# Altium project lockdriver.PrjPCB
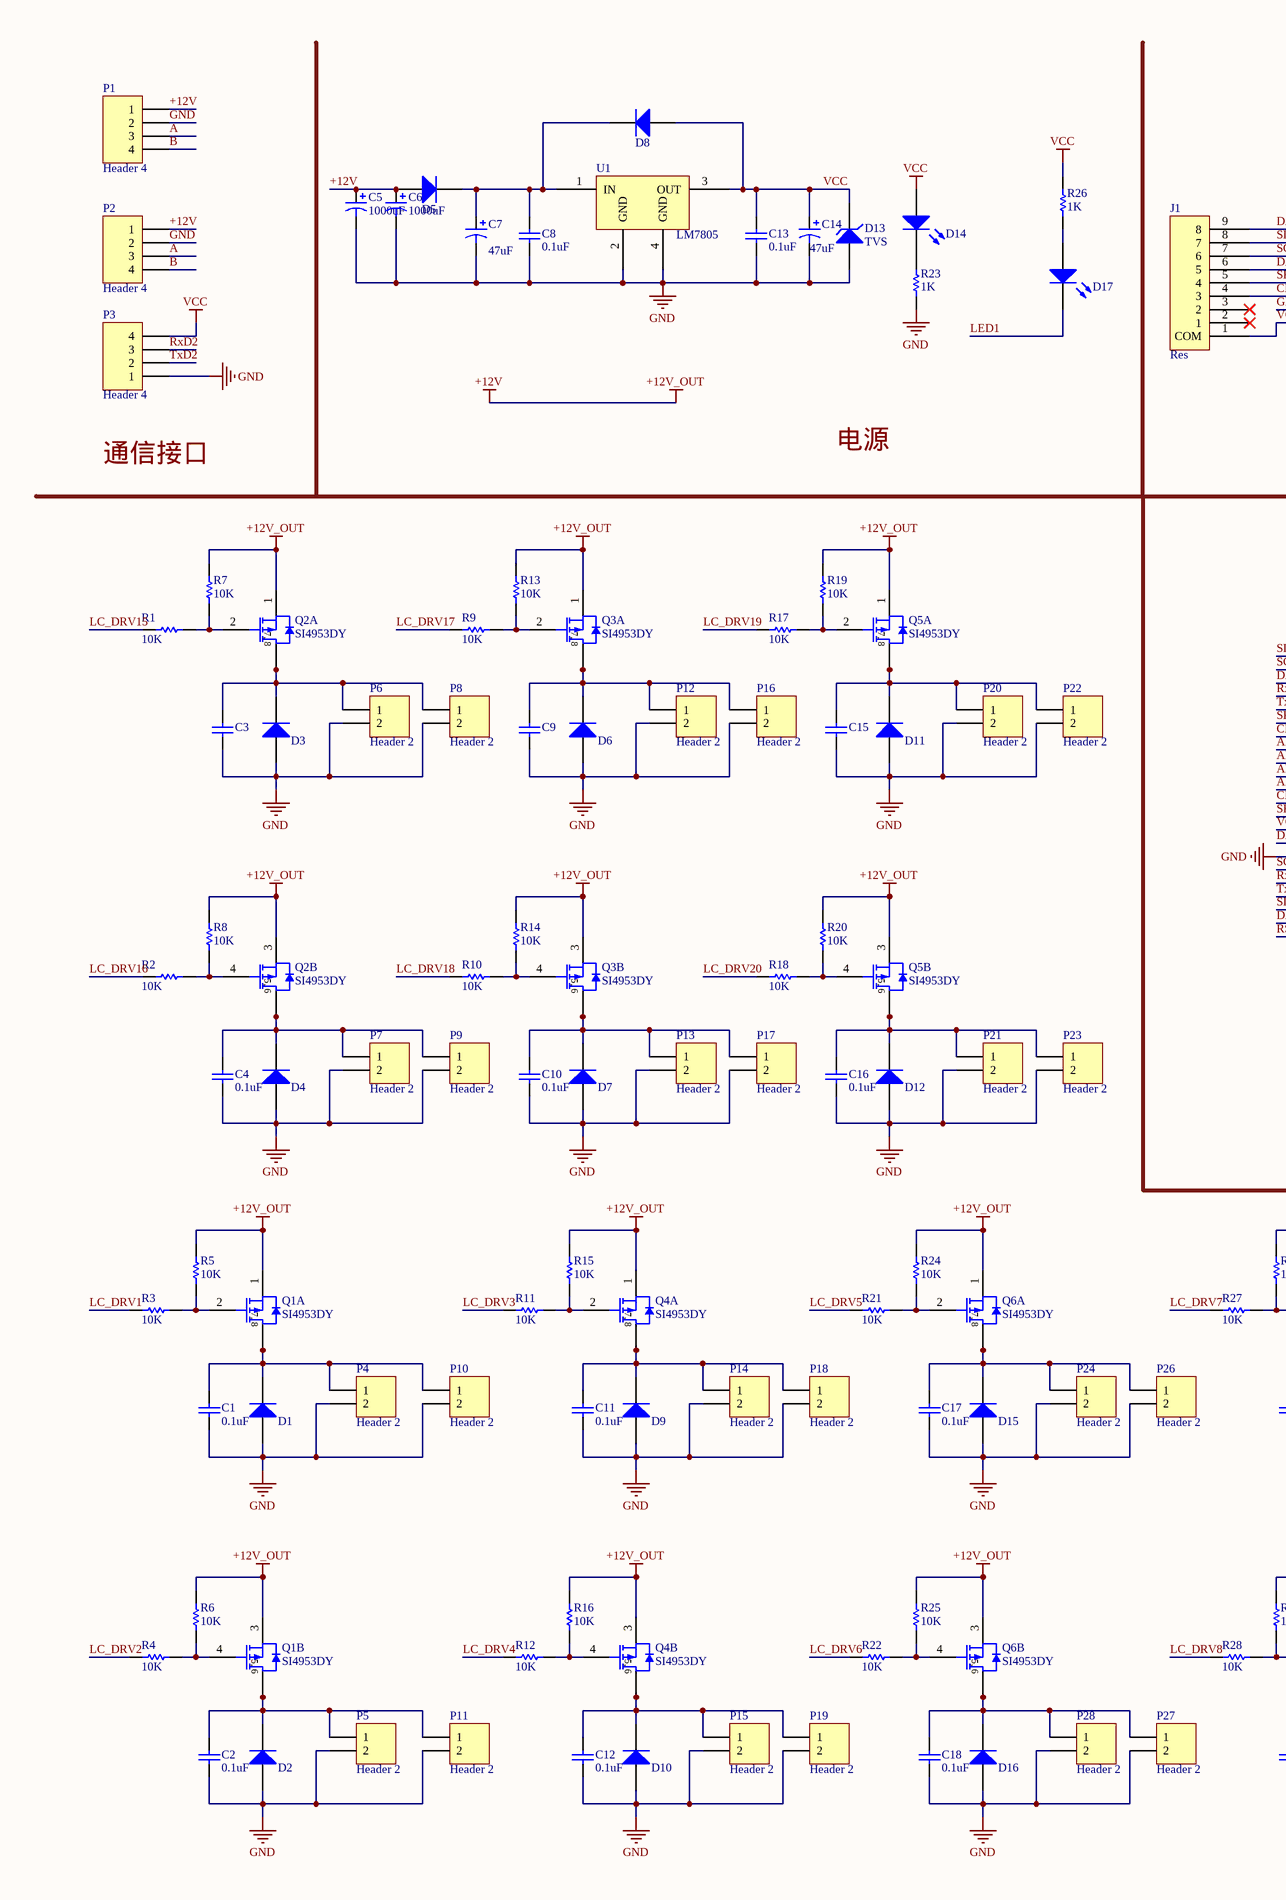
[diagram p0: lockdriver.SchDoc, left]
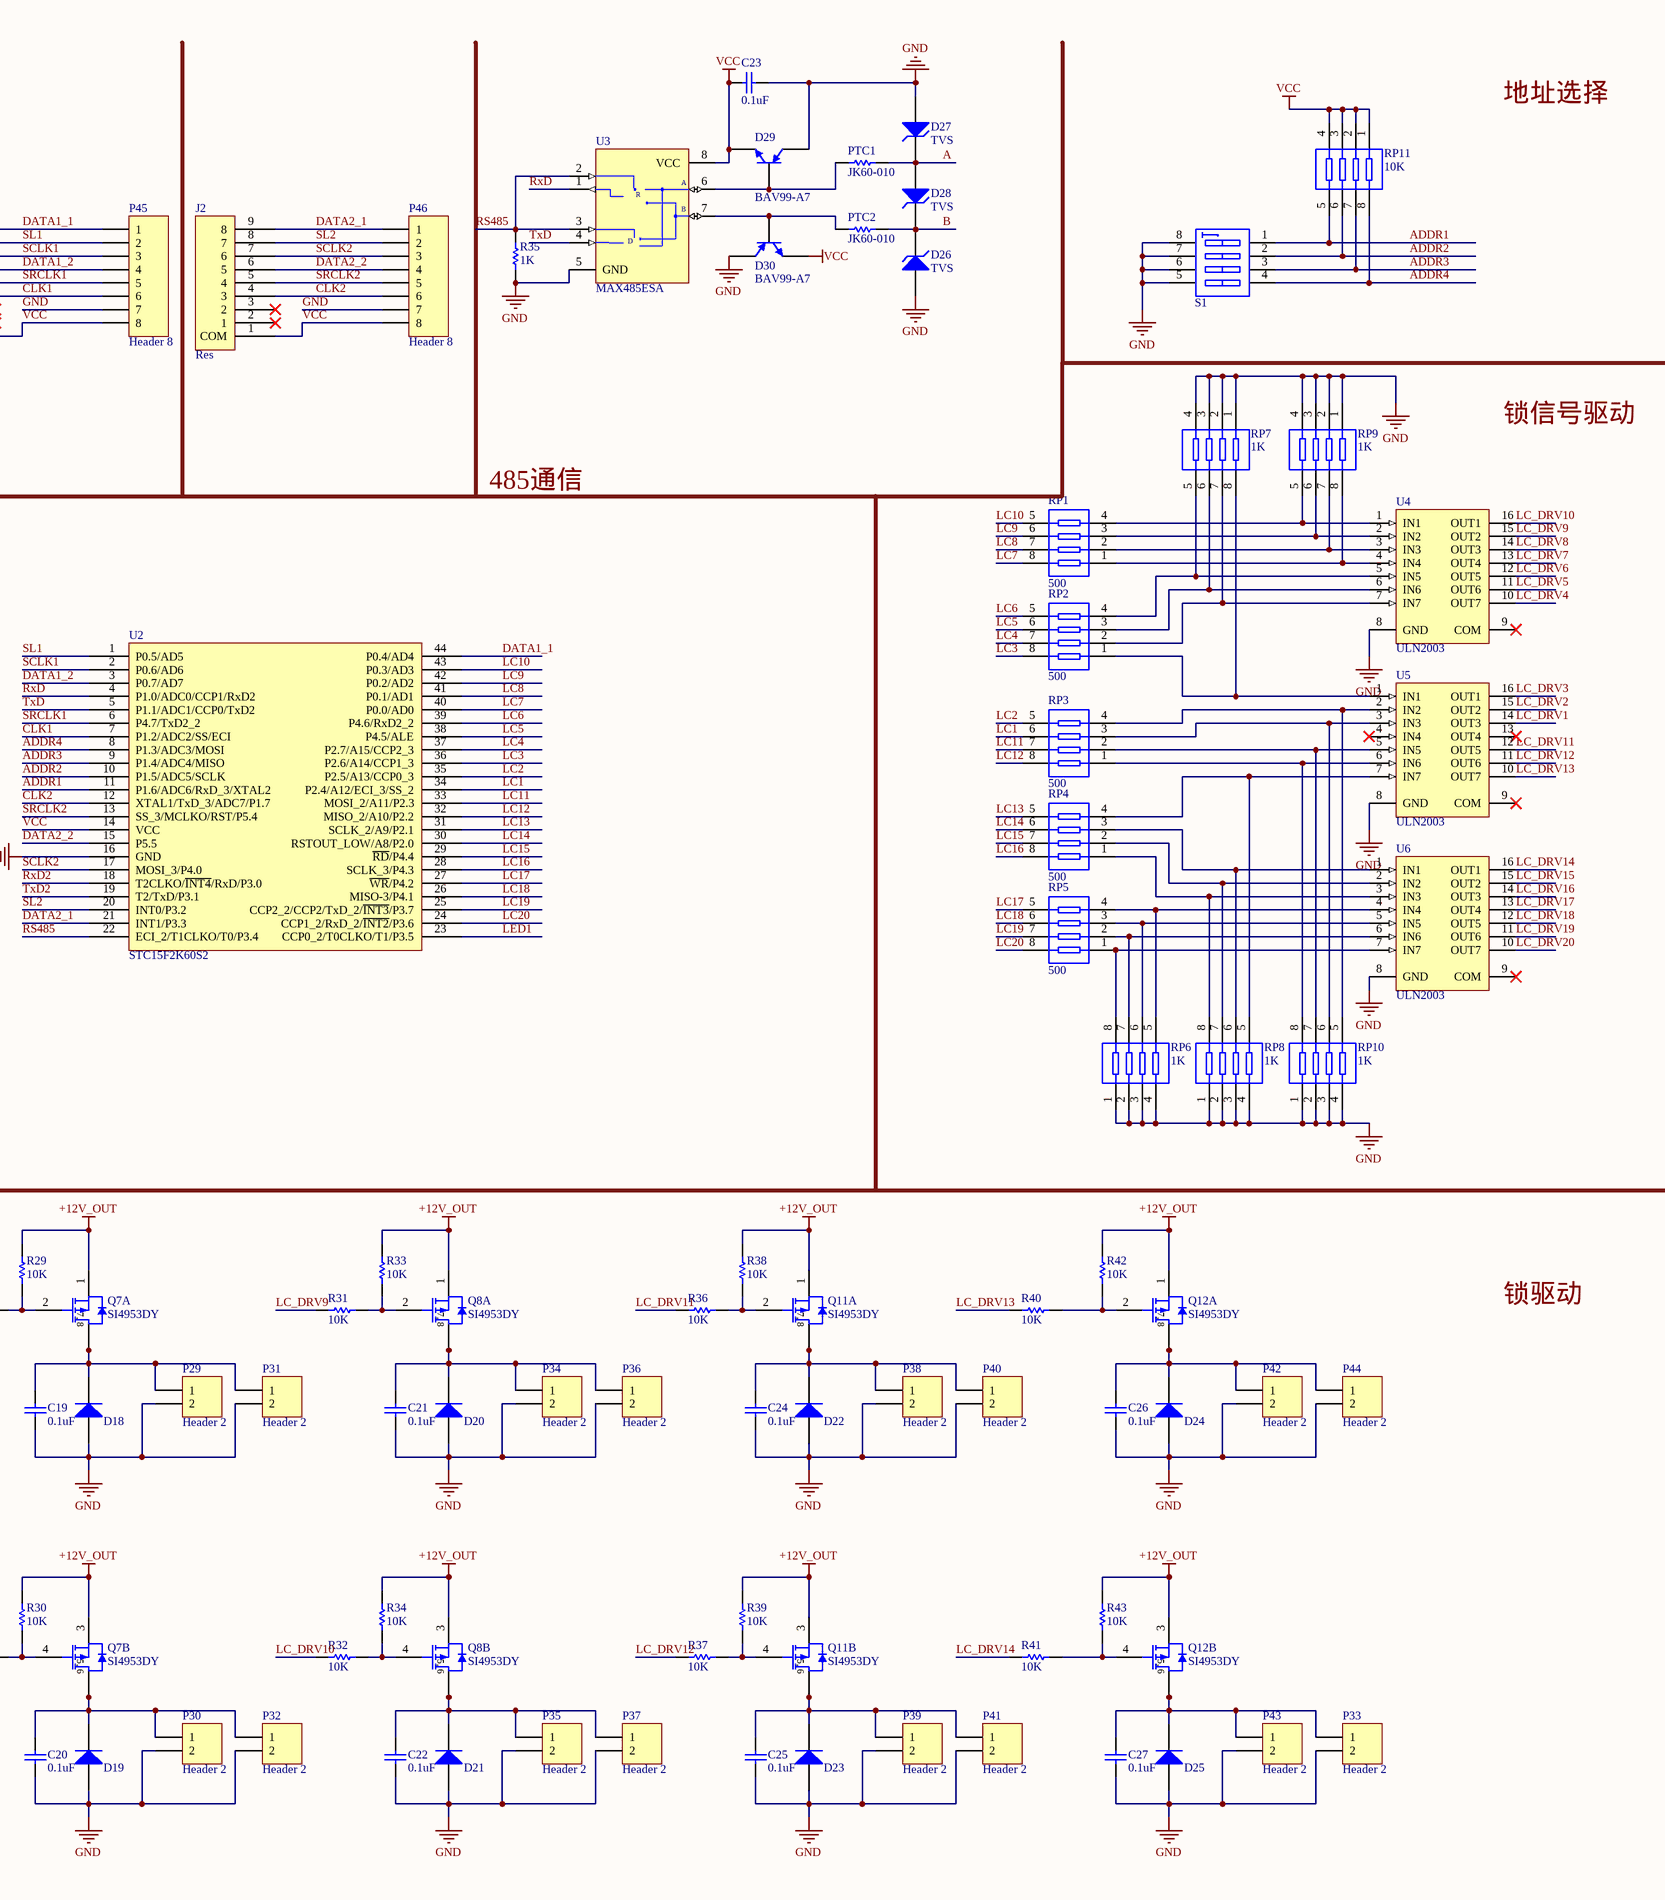
[diagram p1: lockdriver.SchDoc, right]
1 sheet, 177 parts. Net scope: global (net labels, ports and power ports of the same name join across sheets).
Board file: 20门锁控.PcbDoc

## Sheet lockdriver.SchDoc
size A2

### Parts
C1  0.1uF  [CAPC2012M]
C2  0.1uF  [CAPC2012M]
C3  0.1uF  [CAPC2012M]  (value not drawn)
C4  0.1uF  [CAPC2012M]
C5  1000uF  [CAPPR5-10x12.5]
C6  1000uF  [CAPPR5-10x12.5]
C7  value 47uF  [CAPPR2-5x11.5]  (hidden comment: Cap Pol2)
C8  0.1uF  [CAPC2012M]
C9  0.1uF  [CAPC2012M]  (value not drawn)
C10  0.1uF  [CAPC2012M]
C11  0.1uF  [CAPC2012M]
C12  0.1uF  [CAPC2012M]
C13  0.1uF  [CAPC2012M]
C14  value 47uF  [CAPPR2-5x11.5]  (hidden comment: Cap Pol2)
C15  0.1uF  [CAPC2012M]  (value not drawn)
C16  0.1uF  [CAPC2012M]
C17  0.1uF  [CAPC2012M]
C18  0.1uF  [CAPC2012M]
C19  0.1uF  [CAPC2012M]
C20  0.1uF  [CAPC2012M]
C21  0.1uF  [CAPC2012M]
C22  0.1uF  [CAPC2012M]
C23  0.1uF  [CAPC2012M]
C24  0.1uF  [CAPC2012M]
C25  0.1uF  [CAPC2012M]
C26  0.1uF  [CAPC2012M]
C27  0.1uF  [CAPC2012M]
D1  1N4007  [DSO-C2/X1.8]  (value not drawn)
D2  1N4007  [DSO-C2/X1.8]  (value not drawn)
D3  1N4007  [DSO-C2/X1.8]  (value not drawn)
D4  1N4007  [DSO-C2/X1.8]  (value not drawn)
D5  1N4007  [DSO-C2/X1.8]  (value not drawn)
D6  1N4007  [DSO-C2/X1.8]  (value not drawn)
D7  1N4007  [DSO-C2/X1.8]  (value not drawn)
D8  1N4007  [DSO-C2/X1.8]  (value not drawn)
D9  1N4007  [DSO-C2/X1.8]  (value not drawn)
D10  1N4007  [DSO-C2/X1.8]  (value not drawn)
D11  1N4007  [DSO-C2/X1.8]  (value not drawn)
D12  1N4007  [DSO-C2/X1.8]  (value not drawn)
D13  TVS  [DSO-C2/X1.8]
D14  LED  [LED2012M]  (value not drawn)
D15  1N4007  [DSO-C2/X1.8]  (value not drawn)
D16  1N4007  [DSO-C2/X1.8]  (value not drawn)
D17  LED  [LED2012M]  (value not drawn)
D18  1N4007  [DSO-C2/X1.8]  (value not drawn)
D19  1N4007  [DSO-C2/X1.8]  (value not drawn)
D20  1N4007  [DSO-C2/X1.8]  (value not drawn)
D21  1N4007  [DSO-C2/X1.8]  (value not drawn)
D22  1N4007  [DSO-C2/X1.8]  (value not drawn)
D23  1N4007  [DSO-C2/X1.8]  (value not drawn)
D24  1N4007  [DSO-C2/X1.8]  (value not drawn)
D25  1N4007  [DSO-C2/X1.8]  (value not drawn)
D26  TVS  [DSO-C2/X1.8]
D27  TVS  [DSO-C2/X1.8]
D28  TVS  [DSO-C2/X1.8]
D29  BAV99-A7  [SOT23-3M]
D30  BAV99-A7  [SOT23-3M]
J1  Res  [SIP9]
J2  Res  [SIP9]
P1  Header 4  [VH396-4]
P2  Header 4  [VH396-4]
P3  Header 4  [HDR1X4]
P4  Header 2  [VH396-2]
P5  Header 2  [VH396-2]
P6  Header 2  [VH396-2]
P7  Header 2  [VH396-2]
P8  Header 2  [XH254-2]
P9  Header 2  [XH254-2]
P10  Header 2  [XH254-2]
P11  Header 2  [XH254-2]
P12  Header 2  [VH396-2]
P13  Header 2  [VH396-2]
P14  Header 2  [VH396-2]
P15  Header 2  [VH396-2]
P16  Header 2  [XH254-2]
P17  Header 2  [XH254-2]
P18  Header 2  [XH254-2]
P19  Header 2  [XH254-2]
P20  Header 2  [VH396-2]
P21  Header 2  [VH396-2]
P22  Header 2  [XH254-2]
P23  Header 2  [XH254-2]
P24  Header 2  [VH396-2]
P26  Header 2  [XH254-2]
P27  Header 2  [XH254-2]
P28  Header 2  [VH396-2]
P29  Header 2  [VH396-2]
P30  Header 2  [VH396-2]
P31  Header 2  [XH254-2]
P32  Header 2  [XH254-2]
P33  Header 2  [XH254-2]
P34  Header 2  [VH396-2]
P35  Header 2  [VH396-2]
P36  Header 2  [XH254-2]
P37  Header 2  [XH254-2]
P38  Header 2  [VH396-2]
P39  Header 2  [VH396-2]
P40  Header 2  [XH254-2]
P41  Header 2  [XH254-2]
P42  Header 2  [VH396-2]
P43  Header 2  [VH396-2]
P44  Header 2  [XH254-2]
P45  Header 8  [XH254-8]
P46  Header 8  [XH254-8]
PTC1  JK60-010  [RESC2012M]
PTC2  JK60-010  [RESC2012M]
Q1  SI4953DY  [SO8_M]  (parts A,B of 2)
Q2  SI4953DY  [SO8_M]  (parts A,B of 2)
Q3  SI4953DY  [SO8_M]  (parts A,B of 2)
Q4  SI4953DY  [SO8_M]  (parts A,B of 2)
Q5  SI4953DY  [SO8_M]  (parts A,B of 2)
Q6  SI4953DY  [SO8_M]  (parts A,B of 2)
Q7  SI4953DY  [SO8_M]  (parts A,B of 2)
Q8  SI4953DY  [SO8_M]  (parts A,B of 2)
Q11  SI4953DY  [SO8_M]  (parts A,B of 2)
Q12  SI4953DY  [SO8_M]  (parts A,B of 2)
R1  10K  [RESC2012M]
R2  10K  [RESC2012M]
R3  10K  [RESC2012M]
R4  10K  [RESC2012M]
R5  10K  [RESC2012M]
R6  10K  [RESC2012M]
R7  10K  [RESC2012M]
R8  10K  [RESC2012M]
R9  10K  [RESC2012M]
R10  10K  [RESC2012M]
R11  10K  [RESC2012M]
R12  10K  [RESC2012M]
R13  10K  [RESC2012M]
R14  10K  [RESC2012M]
R15  10K  [RESC2012M]
R16  10K  [RESC2012M]
R17  10K  [RESC2012M]
R18  10K  [RESC2012M]
R19  10K  [RESC2012M]
R20  10K  [RESC2012M]
R21  10K  [RESC2012M]
R22  10K  [RESC2012M]
R23  1K  [RESC2012M]
R24  10K  [RESC2012M]
R25  10K  [RESC2012M]
R26  1K  [RESC2012M]
R27  10K  [RESC2012M]
R28  10K  [RESC2012M]
R29  10K  [RESC2012M]
R30  10K  [RESC2012M]
R31  10K  [RESC2012M]
R32  10K  [RESC2012M]
R33  10K  [RESC2012M]
R34  10K  [RESC2012M]
R35  1K  [RESC2012M]
R36  10K  [RESC2012M]
R37  10K  [RESC2012M]
R38  10K  [RESC2012M]
R39  10K  [RESC2012M]
R40  10K  [RESC2012M]
R41  10K  [RESC2012M]
R42  10K  [RESC2012M]
R43  10K  [RESC2012M]
RP1  500  [EXB38V]
RP2  500  [EXB38V]
RP3  500  [EXB38V]
RP4  500  [EXB38V]
RP5  500  [EXB38V]
RP6  1K  [EXB38V]
RP7  1K  [EXB38V]
RP8  1K  [EXB38V]
RP9  1K  [EXB38V]
RP10  1K  [EXB38V]
RP11  10K  [EXB38V]
S1  SW DIP-4  [SWITCH-8]  (value not drawn)
U1  LM7805  [SOT223-4M]
U2  STC15F2K60S2  [LQFP-44]
U3  MAX485ESA  [SO8_M]
U4  ULN2003  [SO16_M]
U5  ULN2003  [SO16_M]
U6  ULN2003  [SO16_M]

### Nets
+12V: C5.1 C6.1 D5.1(A) P1.1 P2.1 Q1.1(S) Q1.3(S) Q2.1(S) Q2.3(S) Q3.1(S) Q3.3(S) Q4.1(S) Q4.3(S) Q5.1(S) Q5.3(S) Q6.1(S) Q6.3(S) Q7.1(S) Q7.3(S) Q8.1(S) Q8.3(S) Q11.1(S) Q11.3(S) Q12.1(S) Q12.3(S) R5.2 R6.2 R7.2 R8.2 R13.2 R14.2 R15.2 R16.2 R19.2 R20.2 R24.2 R25.2 R29.2 R30.2 R33.2 R34.2 R38.2 R39.2 R42.2 R43.2  [also labelled +12V_OUT]
GND: C1.1 C2.1 C3.1 C4.1 C5.2 C6.2 C7.2 C8.1 C9.1 C10.1 C11.1 C12.1 C13.2 C14.2 C15.1 C16.1 C17.1 C18.1 C19.1 C20.1 C21.1 C22.1 C23.2 C24.1 C25.1 C26.1 C27.1 D1.1(A) D2.1(A) D3.1(A) D4.1(A) D6.1(A) D7.1(A) D9.1(A) D10.1(A) D11.1(A) D12.1(A) D13.1(A) D15.1(A) D16.1(A) D18.1(A) D19.1(A) D20.1(A) D21.1(A) D22.1(A) D23.1(A) D24.1(A) D25.1(A) D26.1(A) D27.1(A) D29.1(C) D30.1(C) P1.2 P2.2 P3.1 P4.2 P5.2 P6.2 P7.2 P8.2 P9.2 P10.2 P11.2 P12.2 P13.2 P14.2 P15.2 P16.2 P17.2 P18.2 P19.2 P20.2 P21.2 P22.2 P23.2 P24.2 P26.2 P27.2 P28.2 P29.2 P30.2 P31.2 P32.2 P33.2 P34.2 P35.2 P36.2 P37.2 P38.2 P39.2 P40.2 P41.2 P42.2 P43.2 P44.2 P45.7 P46.7 R23.1 R35.1 RP6.1 RP6.2 RP6.3 RP6.4 RP7.1 RP7.2 RP7.3 RP7.4 RP8.1 RP8.2 RP8.3 RP8.4 RP9.1 RP9.2 RP9.3 RP9.4 RP10.1 RP10.2 RP10.3 RP10.4 S1.5(B4) S1.6(B3) S1.7(B2) S1.8(B1) U1.2(GND) U1.4(GND) U2.16(GND) U3.5(GND) U4.8(GND) U5.8(GND) U6.8(GND)
VCC: C13.1 C14.1 C23.1 D8.1(A) D13.2(K) D14.1(A) D29.2(E) D30.2(E) J1.1(COM) J2.1(COM) P3.4 P45.8 P46.8 R26.2 RP11.1 RP11.2 RP11.3 RP11.4 U1.3(OUT) U2.14(VCC) U3.8(VCC)
A: D27.2(K) D28.1(A) P1.3 P2.3 PTC1.2
ADDR1: RP11.5 S1.1(A1) U2.11(P1.6/ADC6/RxD_3/XTAL2)
ADDR2: RP11.6 S1.2(A2) U2.10(P1.5/ADC5/SCLK)
ADDR3: RP11.7 S1.3(A3) U2.9(P1.4/ADC4/MISO)
ADDR4: RP11.8 S1.4(A4) U2.8(P1.3/ADC3/MOSI)
B: D26.2(K) D28.2(K) P1.4 P2.4 PTC2.2
CLK1: J1.4(3) P45.6 U2.7(P1.2/ADC2/SS/ECI)
CLK2: J2.4(3) P46.6 U2.12(XTAL1/TxD_3/ADC7/P1.7)
DATA1_1: J1.9(8) P45.1 U2.44(P0.4/AD4)
DATA1_2: J1.6(5) P45.4 U2.3(P0.7/AD7)
DATA2_1: J2.9(8) P46.1 U2.21(INT1/P3.3)
DATA2_2: J2.6(5) P46.4 U2.15(P5.5)
LC1: RP3.6 U2.34(P2.4/A12/ECI_3/SS_2)
LC2: RP3.5 U2.35(P2.5/A13/CCP0_3)
LC3: RP2.8 U2.36(P2.6/A14/CCP1_3)
LC4: RP2.7 U2.37(P2.7/A15/CCP2_3)
LC5: RP2.6 U2.38(P4.5/ALE)
LC6: RP2.5 U2.39(P4.6/RxD2_2)
LC7: RP1.8 U2.40(P0.0/AD0)
LC8: RP1.7 U2.41(P0.1/AD1)
LC9: RP1.6 U2.42(P0.2/AD2)
LC10: RP1.5 U2.43(P0.3/AD3)
LC11: RP3.7 U2.33(MOSI_2/A11/P2.3)
LC12: RP3.8 U2.32(MISO_2/A10/P2.2)
LC13: RP4.5 U2.31(SCLK_2/A9/P2.1)
LC14: RP4.6 U2.30(RSTOUT_LOW/A8/P2.0)
LC15: RP4.7 U2.29(~{RD}/P4.4)
LC16: RP4.8 U2.28(SCLK_3/P4.3)
LC17: RP5.5 U2.27(~{WR}/P4.2)
LC18: RP5.6 U2.26(MISO-3/P4.1)
LC19: RP5.7 U2.25(CCP2_2/CCP2/TxD_2/~{INT3}/P3.7)
LC20: RP5.8 U2.24(CCP1_2/RxD_2/~{INT2}/P3.6)
LC_DRV1: R3.1 U5.14(OUT3)
LC_DRV2: R4.1 U5.15(OUT2)
LC_DRV3: R11.1 U5.16(OUT1)
LC_DRV4: R12.1 U4.10(OUT7)
LC_DRV5: R21.1 U4.11(OUT6)
LC_DRV6: R22.1 U4.12(OUT5)
LC_DRV7: R27.1 U4.13(OUT4)
LC_DRV8: R28.1 U4.14(OUT3)
LC_DRV9: R31.1 U4.15(OUT2)
LC_DRV10: R32.1 U4.16(OUT1)
LC_DRV11: R36.1 U5.12(OUT5)
LC_DRV12: R37.1 U5.11(OUT6)
LC_DRV13: R40.1 U5.10(OUT7)
LC_DRV14: R41.1 U6.16(OUT1)
LC_DRV15: R1.1 U6.15(OUT2)
LC_DRV16: R2.1 U6.14(OUT3)
LC_DRV17: R9.1 U6.13(OUT4)
LC_DRV18: R10.1 U6.12(OUT5)
LC_DRV19: R17.1 U6.11(OUT6)
LC_DRV20: R18.1 U6.10(OUT7)
LED1: D17.2(K) U2.23(CCP0_2/T0CLKO/T1/P3.5)
RS485: R35.2 U2.22(ECI_2/T1CLKO/T0/P3.4) U3.2(~{RE}) U3.3(DE)
RxD: U2.4(P1.0/ADC0/CCP1/RxD2) U3.1(RO)
RxD2: P3.3 U2.18(T2CLKO/~{INT4}/RxD/P3.0)
SCLK1: J1.7(6) P45.3 U2.2(P0.6/AD6)
SCLK2: J2.7(6) P46.3 U2.17(MOSI_3/P4.0)
SL1: J1.8(7) P45.2 U2.1(P0.5/AD5)
SL2: J2.8(7) P46.2 U2.20(INT0/P3.2)
SRCLK1: J1.5(4) P45.5 U2.6(P4.7/TxD2_2)
SRCLK2: J2.5(4) P46.5 U2.13(SS_3/MCLKO/RST/P5.4)
TxD: U2.5(P1.1/ADC1/CCP0/TxD2) U3.4(DI)
TxD2: P3.2 U2.19(T2/TxD/P3.1)
NetC1_2: C1.2 D1.2(K) P4.1 P10.1 Q1.7(D) Q1.8(D)
NetC2_2: C2.2 D2.2(K) P5.1 P11.1 Q1.5(D) Q1.6(D)
NetC3_2: C3.2 D3.2(K) P6.1 P8.1 Q2.7(D) Q2.8(D)
NetC4_2: C4.2 D4.2(K) P7.1 P9.1 Q2.5(D) Q2.6(D)
NetC7_1: C7.1 C8.2 D5.2(K) D8.2(K) U1.1(IN)
NetC9_2: C9.2 D6.2(K) P12.1 P16.1 Q3.7(D) Q3.8(D)
NetC10_2: C10.2 D7.2(K) P13.1 P17.1 Q3.5(D) Q3.6(D)
NetC11_2: C11.2 D9.2(K) P14.1 P18.1 Q4.7(D) Q4.8(D)
NetC12_2: C12.2 D10.2(K) P15.1 P19.1 Q4.5(D) Q4.6(D)
NetC15_2: C15.2 D11.2(K) P20.1 P22.1 Q5.7(D) Q5.8(D)
NetC16_2: C16.2 D12.2(K) P21.1 P23.1 Q5.5(D) Q5.6(D)
NetC17_2: C17.2 D15.2(K) P24.1 P26.1 Q6.7(D) Q6.8(D)
NetC18_2: C18.2 D16.2(K) P27.1 P28.1 Q6.5(D) Q6.6(D)
NetC19_2: C19.2 D18.2(K) P29.1 P31.1 Q7.7(D) Q7.8(D)
NetC20_2: C20.2 D19.2(K) P30.1 P32.1 Q7.5(D) Q7.6(D)
NetC21_2: C21.2 D20.2(K) P34.1 P36.1 Q8.7(D) Q8.8(D)
NetC22_2: C22.2 D21.2(K) P35.1 P37.1 Q8.5(D) Q8.6(D)
NetC24_2: C24.2 D22.2(K) P38.1 P40.1 Q11.7(D) Q11.8(D)
NetC25_2: C25.2 D23.2(K) P39.1 P41.1 Q11.5(D) Q11.6(D)
NetC26_2: C26.2 D24.2(K) P42.1 P44.1 Q12.7(D) Q12.8(D)
NetC27_2: C27.2 D25.2(K) P33.1 P43.1 Q12.5(D) Q12.6(D)
NetD14_2: D14.2(K) R23.2
NetD17_1: D17.1(A) R26.1
NetD29_3: D29.3(B) PTC1.1 U3.6(A)
NetD30_3: D30.3(B) PTC2.1 U3.7(B)
NetQ1_2: Q1.2(G) R3.2 R5.1
NetQ1_4: Q1.4(G) R4.2 R6.1
NetQ2_2: Q2.2(G) R1.2 R7.1
NetQ2_4: Q2.4(G) R2.2 R8.1
NetQ3_2: Q3.2(G) R9.2 R13.1
NetQ3_4: Q3.4(G) R10.2 R14.1
NetQ4_2: Q4.2(G) R11.2 R15.1
NetQ4_4: Q4.4(G) R12.2 R16.1
NetQ5_2: Q5.2(G) R17.2 R19.1
NetQ5_4: Q5.4(G) R18.2 R20.1
NetQ6_2: Q6.2(G) R21.2 R24.1
NetQ6_4: Q6.4(G) R22.2 R25.1
NetQ7_2: Q7.2(G) R27.2 R29.1
NetQ7_4: Q7.4(G) R28.2 R30.1
NetQ8_2: Q8.2(G) R31.2 R33.1
NetQ8_4: Q8.4(G) R32.2 R34.1
NetQ11_2: Q11.2(G) R36.2 R38.1
NetQ11_4: Q11.4(G) R37.2 R39.1
NetQ12_2: Q12.2(G) R40.2 R42.1
NetQ12_4: Q12.4(G) R41.2 R43.1
NetRP1_1: RP1.1 RP9.8 U4.4(IN4)
NetRP1_2: RP1.2 RP9.7 U4.3(IN3)
NetRP1_3: RP1.3 RP9.6 U4.2(IN2)
NetRP1_4: RP1.4 RP9.5 U4.1(IN1)
NetRP2_1: RP2.1 RP7.8 U5.1(IN1)
NetRP2_2: RP2.2 RP7.7 U4.7(IN7)
NetRP2_3: RP2.3 RP7.6 U4.6(IN6)
NetRP2_4: RP2.4 RP7.5 U4.5(IN5)
NetRP3_1: RP3.1 RP10.8 U5.6(IN6)
NetRP3_2: RP3.2 RP10.7 U5.5(IN5)
NetRP3_3: RP3.3 RP10.6 U5.3(IN3)
NetRP3_4: RP3.4 RP10.5 U5.2(IN2)
NetRP4_1: RP4.1 RP8.8 U6.3(IN3)
NetRP4_2: RP4.2 RP8.7 U6.2(IN2)
NetRP4_3: RP4.3 RP8.6 U6.1(IN1)
NetRP4_4: RP4.4 RP8.5 U5.7(IN7)
NetRP5_1: RP5.1 RP6.8 U6.7(IN7)
NetRP5_2: RP5.2 RP6.7 U6.6(IN6)
NetRP5_3: RP5.3 RP6.6 U6.5(IN5)
NetRP5_4: RP5.4 RP6.5 U6.4(IN4)

Not connected (* = marked no-connect by the designer): J1 2(1)* 3(2)*; J2 2(1)* 3(2)*; U4 9(COM)*; U5 4(IN4)* 9(COM)* 13(OUT4)*; U6 9(COM)*

### Notes on the sheet
- 地址选择
- 电源
- 锁信号驱动
- 通信接口
- 485通信
- 锁驱动
- (in symbol MAX485ESA) R; D
- (in symbol SI4953DY, part A) 7, 8
- (in symbol SI4953DY, part B) 5, 6

### Library data of the parts
C1-C4 C8-C13 C15-C27 = Cap: Capacitor; Published: 8-Jun-2000; LatestRevisionDate: 17-Jul-2002; LatestRevisionNote: Re-released for DXP Platform.; PackageReference: RAD-0.3; Publisher: Altium Limited; PackageDescription: Radial Cap, Thru-Hole; 2 Leads; 0.3 in Pin Spacing; Value: 0.1uF
C5 C6 = Cap Pol4: Polarized Capacitor (1000uf); Published: 8-Jun-2000; LatestRevisionDate: 17-Jul-2002; LatestRevisionNote: Re-released for DXP Platform.; Publisher: Altium Limited; PackageDescription: Polarized Capacitor; 2 Leads; Value: 1000uF
C7 C14 = Cap Pol2: Polarized Capacitor (22uf-47uf); Published: 8-Jun-2000; LatestRevisionDate: 17-Jul-2002; LatestRevisionNote: Re-released for DXP Platform.; Publisher: Altium Limited; PackageDescription: Polarized Capacitor; 2 Leads
D1-D12 D15 D16 D18-D25 = Diode: Default Diode; Published: 8-Jun-2000; LatestRevisionDate: 17-Jul-2002; LatestRevisionNote: Re-released for DXP Platform.; PackageVersion: Sep-1996; PackageReference: SMC; Publisher: Altium Limited; PackageDescription: DO-214-AB/SMC; 2 C-Bend Leads; Body 7.9 x 5.9 mm, inc. leads (LxW); Code_JEDEC: DO-214-AB; Value: 1N4007
D13 D26-D28 = TVS: TVS瞬态抑制二极管; Published: 8-Jun-2000; LatestRevisionDate: 17-Jul-2002; LatestRevisionNote: Re-released for DXP Platform.; PackageReference: DIODE-0.7; Publisher: Altium Limited; PackageDescription: Diode, Thru-Hole; 2 Leads; 0.7 in Pin Spacing
D14 D17 = LED: Typical INFRARED GaAs LED; Published: 8-Jun-2000; LatestRevisionDate: 08-Jul-2005; LatestRevisionNote: Mech Layer 1 removed.; PackageReference: LED-0; Publisher: Altium Limited; PackageDescription: LED; 2 Leads
J1 J2 = Res Pack2
P1-P3 = Header 4: Header, 4-Pin; LatestRevisionDate: 17-Jul-2002; LatestRevisionNote: Re-released for DXP Platform.; Publisher: Altium Limited
P4-P24 P26-P44 = Header 2: Header, 2-Pin; LatestRevisionDate: 17-Jul-2002; LatestRevisionNote: Re-released for DXP Platform.; Publisher: Altium Limited
P45 P46 = Header 8: Header, 8-Pin; LatestRevisionDate: 17-Jul-2002; LatestRevisionNote: Re-released for DXP Platform.; Publisher: Altium Limited
PTC1 PTC2 R1-R43 = Res: Resistor; Published: 8-Jun-2000; LatestRevisionDate: 17-Jul-2002; LatestRevisionNote: Re-released for DXP Platform.; PackageReference: AXIAL-0.3; Publisher: Altium Limited; PackageDescription: Axial Device, Thru-Hole; 2 Leads; 0.3 in Pin Spacing
  PTC1 PTC2: Value: JK60-010
  R1-R22 R24 R25 R27-R34 R36-R43: Value: 10K
  R23 R26 R35: Value: 1K
Q1-Q8 Q11 Q12 = SI4953DY: Dual P-Channel 30V (D-S) Rated  MOSFET; Published: 8-Jun-2000; LatestRevisionDate: 13-Apr-2006; LatestRevisionNote: IPC-7351 Footprint Added.; DatasheetVersion: 6-Oct-1997; PackageVersion: Aug-1998; PackageReference: SO-8; Publisher: Altium Limited; PackageDescription: 8-Pin Small Outline Integrated Circuit 1.27 mm Pitch; ComponentLink1Description: Manufacturer Link; ComponentLink1URL: http://www.vishay.com/; ComponentLink2Description: Datasheet; ComponentLink2URL: http://www.vishay.com/docs/70153/70153.pdf
RP1-RP11 = Res Pack
  RP1-RP5: Value: 500
  RP6-RP10: Value: 1K
  RP11: Value: 10K
S1 = SW DIP-4: DIP Switch, 4 Position, SPST; Published: 24-Mar-1999; LatestRevisionDate: 29-May-2009; LatestRevisionNote: IPC-7351 Footprint Added.; PackageVersion: Dec-2002; PackageReference: SO8; Publisher: Altium Limited; PackageDescription: 8-Pin Small Outline Integrated Circuit 1.27 mm Pitch; Code_JEDEC: MS-012-AA; Code_IPC: SOIC127P600-8
U2 = STC15F2K60S2: LQFP44
U3 = MAX485ESA: Low-Power, Slew-Rate-Limited RS-485/RS-422 Transceiver; Published: 16-Jan-2001; LatestRevisionDate: 13-Apr-2006; LatestRevisionNote: IPC-7351 Footprint Added.; DatasheetVersion: Feb-1996; PackageReference: NSO8; Publisher: Altium Limited; PackageDescription: 8-Pin Small Outline Integrated Circuit 1.27 mm Pitch; Code_JEDEC: MS-012-AA; Code_IPC: SOIC127P600-8; ComponentLink1Description: Manufacturer Link; ComponentLink1URL: http://www.maxim-ic.com/; ComponentLink2Description: Datasheet; ComponentLink2URL: http://pdfserv.maxim-ic.com/en/ds/MAX1487-MAX491.pdf
U4-U6 = ULN2003: Seven Darlington Array; Published: 8-Jun-2000; LatestRevisionDate: 13-Apr-2006; LatestRevisionNote: IPC-7351 Footprint Added.; DatasheetVersion: Sep-1998; PackageVersion: May-1998; PackageReference: SO16; Publisher: Altium Limited; PackageDescription: 16-Pin Small Outline Integrated Circuit 1.27 mm Pitch; Code_IPC: SOIC127P600-16; ComponentLink1Description: Manufacturer Link; ComponentLink1URL: http://www.st.com/; ComponentLink2Description: Datasheet; ComponentLink2URL: http://www.st.com/stonline/products/literature/ds/5279/uln2001.pdf